# EAGLE design esq_ordenado (EAGLE 9.6.1)
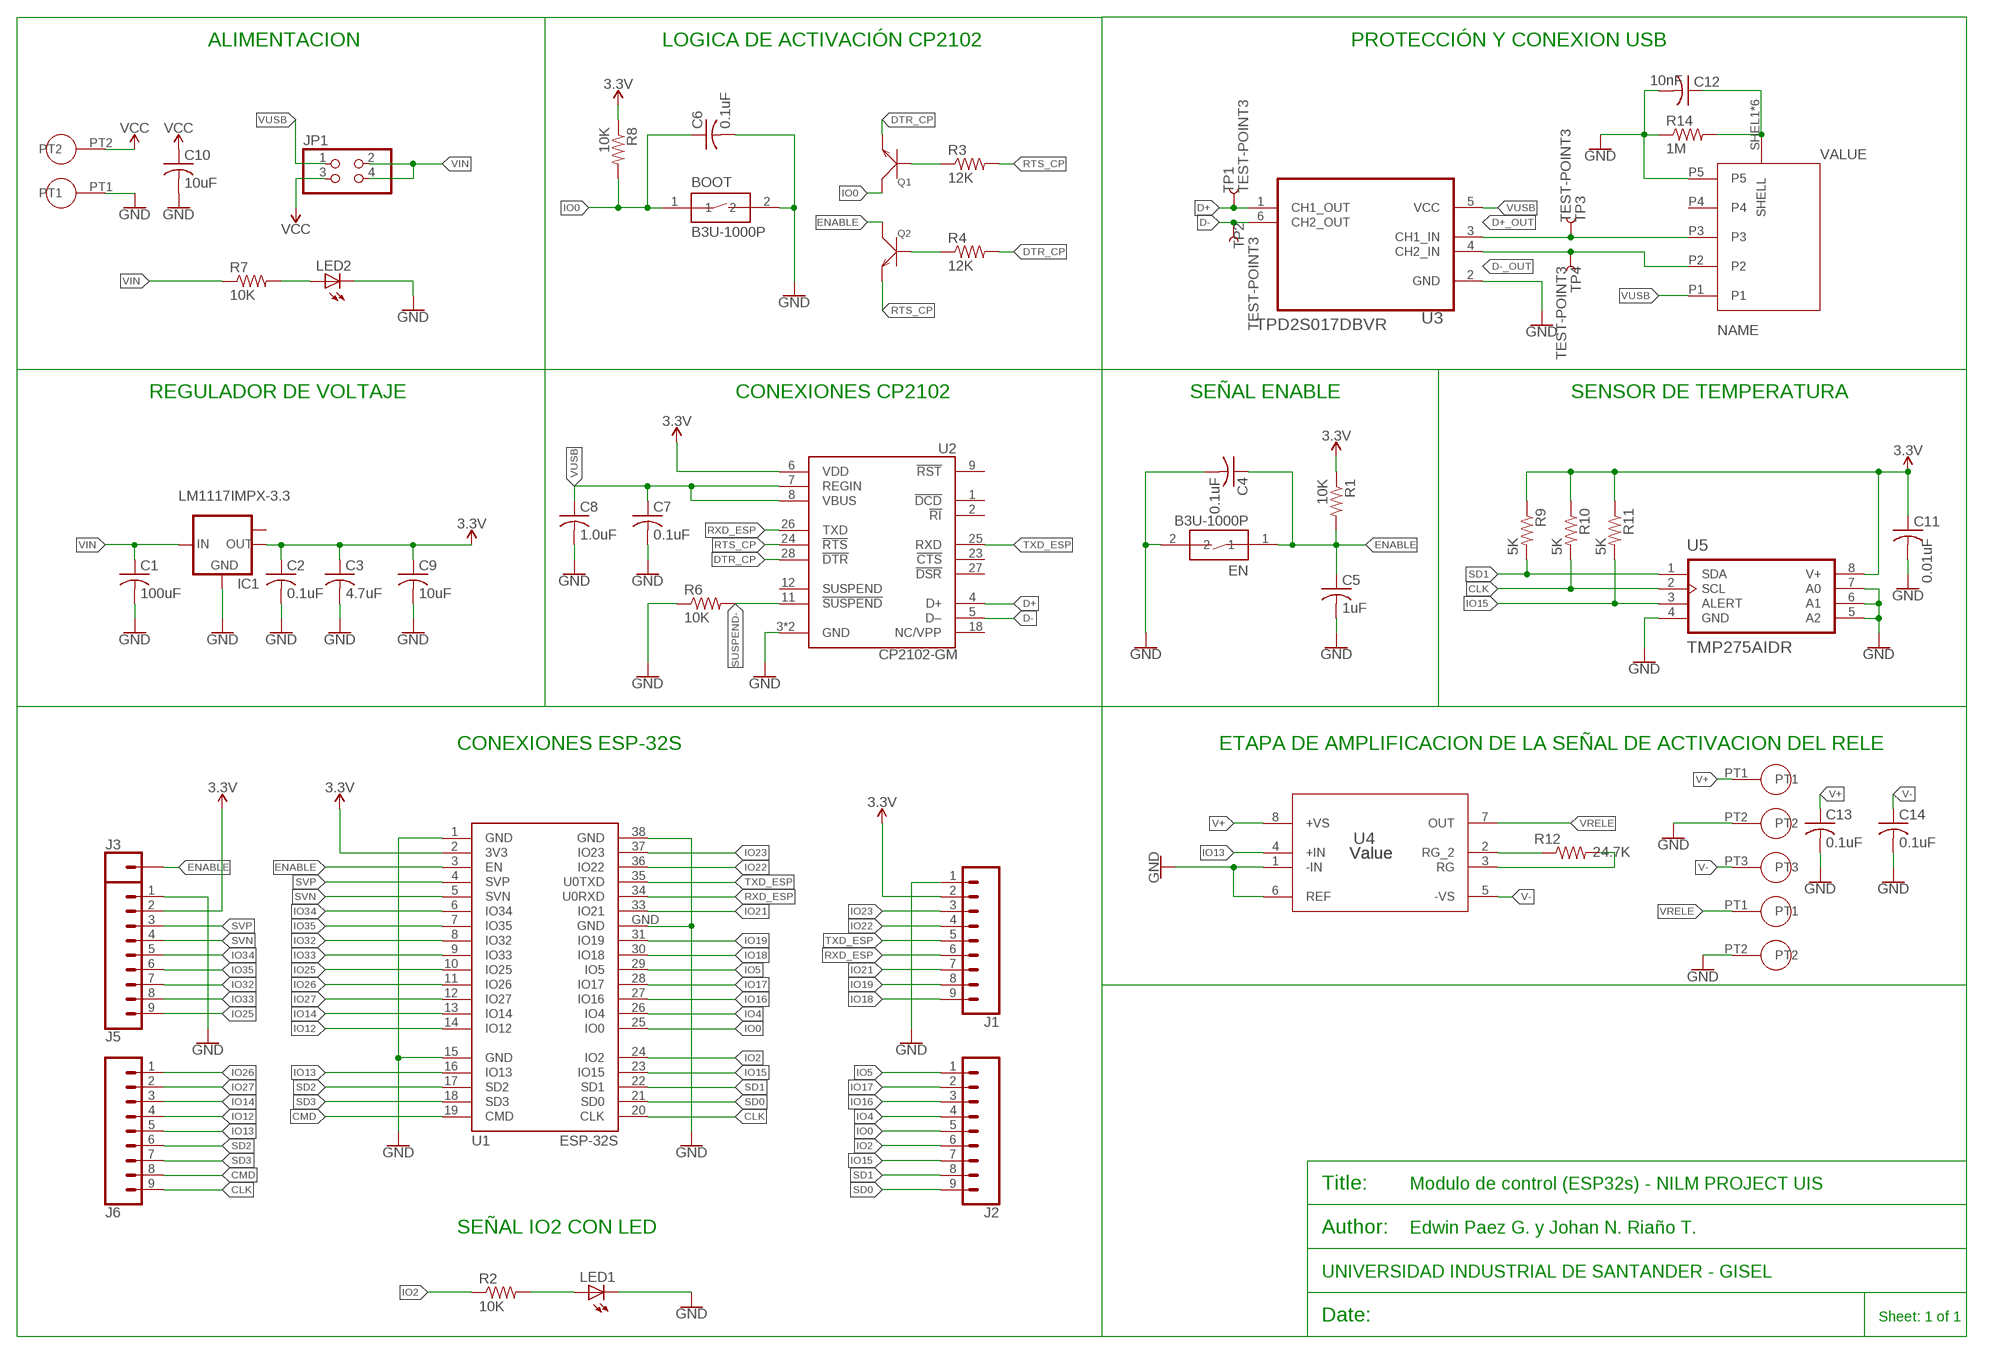
[diagram p0: schematic, sheet 1]

## Parts
BOOT  B3U-1000P  [B3U-1000P]
C1  100uF  C-USC0805  [C0805]
C2  0.1uF  C-USC0805  [C0805]
C3  4.7uF  C-USC0805  [C0805]
C4  0.1uF  C-USC0805  [C0805]
C5  1uF  C-USC0805  [C0805]
C6  0.1uF  C-USC0805  [C0805]
C7  0.1uF  C-USC0805  [C0805]
C8  1.0uF  C-USC0805  [C0805]
C9  10uF  C-USC0805  [C0805]
C10  10uF  C-USC0805  [C0805]
C11  0.01uF  C-USC0805  [C0805]
C12  10nF  C-USC0805  [C0805]
C13  0.1uF  C-USC0805  [C0805]
C14  0.1uF  C-USC0805  [C0805]
EN  B3U-1000P  [B3U-1000P]
IC1  LM1117IMPX-3.3  [SOT223]
J1  CONN_09  [1X09]
J2  CONN_09  [1X09]
J3  CONN_01  [1X01]
J5  CONN_09  [1X09]
J6  CONN_09  [1X09]
JP1  PINHD-2X2  [2X02]
LED1  LEDCHIPLED_0805  [CHIPLED_0805]
LED2  LEDCHIPLED_0805  [CHIPLED_0805]
Q1  SMD-TRANSISTORS-NPN-25V-500MW(SOT-23)  [SOT-23]
Q2  SMD-TRANSISTORS-NPN-25V-500MW(SOT-23)  [SOT-23]
R1  10K  R-US_R0805  [R0805]
R2  10K  R-US_R0805  [R0805]
R3  12K  R-US_R0805  [R0805]
R4  12K  R-US_R0805  [R0805]
R6  10K  R-US_R0805  [R0805]
R7  10K  R-US_R0805  [R0805]
R8  10K  R-US_R0805  [R0805]
R9  5K  R-US_R0805  [R0805]
R10  5K  R-US_R0805  [R0805]
R11  5K  R-US_R0805  [R0805]
R12  24.7K  R-US_R0805  [R0805]
R14  1M  R-US_R0805  [R0805]
TP1  TEST-POINT3  [PAD.03X.03]
TP2  TEST-POINT3  [PAD.03X.03]
TP3  TEST-POINT3  [PAD.03X.03]
TP4  TEST-POINT3  [PAD.03X.03]
U1  ESP-32S  [ESP-32S]
U2  CP2102-GM  [QFN50P500X500X100-29N]
U3  TPD2S017DBVR  [SOT95P280X145-6N]
U4  Value  INA821IDD0008A_M  [D0008A_M]
U5  TMP275AIDR  [TMP275AIDR]
U$1  MICRO_USB_B-AMPHENOL(10118192)  [MICRO_B_10118192]
U$2  PT2,5/2-5,0  [PT2,5/2-5,0]
U$3  PT2,5/2-5,0  [PT2,5/2-5,0]
U$4  PT2,5/3-5,0  [PT2,5/3-5,0]

## Nets
3.3V: C2.1 C3.1 C9.1 C11.1 IC1.2(OUT) J1.2 J5.2 R1.1 R8.1 R9.1 R10.1 R11.1 U1.2(3V3) U2.6(VDD) U5.8(V+)
CLK [PINES_ESP]: J6.9 R10.2 U1.20(CLK) U5.2(SCL)
CMD [PINES_ESP]: J6.8 U1.19(CMD)
D+: TP1.P$1 U2.4(D+) U3.1(CH1_OUT)
D+_OUT: TP3.P$1 U3.3(CH1_IN) U$1.P3
D-: TP2.P$1 U2.5(D–) U3.6(CH2_OUT)
D-_OUT: TP4.P$1 U3.4(CH2_IN) U$1.P2
DTR_CP: Q1.2(E) R4.2 U2.28(!DTR)
ENABLE [PINES_ESP]: C4.1 C5.1 EN.1 J3.1 Q2.3(C) R1.2 U1.3(EN)
GND: BOOT.2 C1.2 C2.2 C3.2 C4.2 C5.2 C6.2 C7.2 C8.2 C9.2 C10.2 C11.2 C12.2 C13.2 C14.2 EN.2 IC1.1(GND) J1.1 J5.1 LED1.C LED2.C R6.1 R14.1 U1.1(GND) U1.15(GND) U1.38(GND) U1.GND U2.3(GND) U2.29(GND) U3.2(GND) U4.1(-IN) U4.6(REF) U5.4(GND) U5.5(A2) U5.6(A1) U5.7(A0) U$1.P5 U$2.PT1 U$3.PT2 U$4.PT2
IO0 [PINES_ESP]: BOOT.1 C6.1 J2.5 Q1.3(C) R8.2 U1.25(IO0)
IO2 [PINES_ESP]: J2.6 R2.1 U1.24(IO2)
IO4 [PINES_ESP]: J2.4 U1.26(IO4)
IO5 [PINES_ESP]: J2.1 U1.29(IO5)
IO12 [PINES_ESP]: J6.4 U1.14(IO12)
IO13 [PINES_ESP]: J6.5 U1.16(IO13) U4.4(+IN)
IO14 [PINES_ESP]: J6.3 U1.13(IO14)
IO15 [PINES_ESP]: J2.7 R11.2 U1.23(IO15) U5.3(ALERT)
IO16 [PINES_ESP]: J2.3 U1.27(IO16)
IO17 [PINES_ESP]: J2.2 U1.28(IO17)
IO18 [PINES_ESP]: J1.9 U1.30(IO18)
IO19 [PINES_ESP]: J1.8 U1.31(IO19)
IO21 [PINES_ESP]: J1.7 U1.33(IO21)
IO22 [PINES_ESP]: J1.4 U1.36(IO22)
IO23 [PINES_ESP]: J1.3 U1.37(IO23)
IO25 [PINES_ESP]: J5.9 U1.10(IO25)
IO26 [PINES_ESP]: J6.1 U1.11(IO26)
IO27 [PINES_ESP]: J6.2 U1.12(IO27)
IO32 [PINES_ESP]: J5.7 U1.8(IO32)
IO33 [PINES_ESP]: J5.8 U1.9(IO33)
IO34 [PINES_ESP]: J5.5 U1.6(IO34)
IO35 [PINES_ESP]: J5.6 U1.7(IO35)
N$2: LED1.A R2.2
N$3: Q1.1(B) R3.1
N$4: Q2.1(B) R4.1
N$6: LED2.A R7.2
N$7: C12.1 R14.2 U$1.SHEL1(SHELL) U$1.SHEL2(SHELL) U$1.SHEL3(SHELL) U$1.SHEL4(SHELL) U$1.SHEL5(SHELL) U$1.SHEL6(SHELL)
N$8: R12.1 U4.2(RG_2)
N$9: R12.2 U4.3(RG)
RTS_CP: Q2.2(E) R3.2 U2.24(!RTS)
RXD_ESP [PINES_ESP]: J1.6 U1.34(U0RXD) U2.26(TXD)
SD0 [PINES_ESP]: J2.9 U1.21(SD0)
SD1 [PINES_ESP]: J2.8 R9.2 U1.22(SD1) U5.1(SDA)
SD2 [PINES_ESP]: J6.6 U1.17(SD2)
SD3 [PINES_ESP]: J6.7 U1.18(SD3)
SUSPEND-: R6.2 U2.11(!SUSPEND)
SVN [PINES_ESP]: J5.4 U1.5(SVN)
SVP [PINES_ESP]: J5.3 U1.4(SVP)
TXD_ESP [PINES_ESP]: J1.5 U1.35(U0TXD) U2.25(RXD)
V+: C13.1 U4.8(+VS) U$4.PT1
V-: C14.1 U4.5(-VS) U$4.PT3
VCC: C10.1 JP1.3 U$2.PT2
VIN: C1.1 IC1.3(IN) JP1.2 JP1.4 R7.1
VRELE: U4.7(OUT) U$3.PT1
VUSB: C7.1 C8.1 JP1.1 U2.7(REGIN) U2.8(VBUS) U3.5(VCC) U$1.P1
Unconnected: IC1.TAB(OUT1) U2.1(!DCD) U2.2(!RI) U2.9(!RST) U2.12(SUSPEND) U2.18(NC/VPP) U2.23(!CTS) U2.27(!DSR) U$1.P4

## Notes on the sheet
- ALIMENTACION | LOGICA DE ACTIVACIÓN CP2102 | PROTECCIÓN Y CONEXION USB
- REGULADOR DE VOLTAJE | CONEXIONES CP2102 | SEÑAL ENABLE | SENSOR DE TEMPERATURA
- CONEXIONES ESP-32S | ETAPA DE AMPLIFICACION DE LA SEÑAL DE ACTIVACION DEL RELE
- Title: | Modulo de control (ESP32s) - NILM PROJECT UIS
- SEÑAL IO2 CON LED | Author: | Edwin Paez G. y Johan N. Riaño T.
- UNIVERSIDAD INDUSTRIAL DE SANTANDER - GISEL
- Date: | Sheet: 1 of 1

## Library data of the parts
BOOT EN = Switch:B3U-1000P: SWITCH TACTILE SPST-NO 0.05A 12V Manufacturer's datasheet <https://omronfs.omron.com/en_US/ecb/products/pdf/en-b3u.pdf>; CREATED_BY: PCBLayout.com; DIGI_KEY_PART_NUMBER: SW1020CT-ND; MANUFACTURER: Omron Electronics Inc-EMC Div; MPN: B3U-1000P; PACKAGE: SPST-NO
C1-C14 = resistor:C-US: CAPACITOR, American symbol
IC1 = lm1117:LM1117IMPX-*
J1 J2 J5 J6 = SparkFun-Connectors:CONN_09: Multi connection point. Often used as Generic Header-pin footprint for 0.1 inch spaced/style header connections On any of the 0.1 inch spaced packages, you can populate with these: Break Away Headers - Straight <https://www.sparkfun.com/products/116> (PRT-00116) Break Away Male Headers - Right Angle <https://www.sparkfun.com/products/553> (PRT-00553) Female Headers <https://www.sparkfun.com/products/115> (PRT-00115) Break Away Headers - Machine Pin <https://www.sparkfun.com/products/117> (PRT-00117) Break Away Female Headers - Swiss Machine Pin <https://www.sparkfun.com/products/743> (PRT-00743) For SCREWTERMINALS and SPRING TERMINALS visit here: Screw Terimnals on SparkFun.com <https://www.sparkfun.com/search/results?term=Screw+Terminals> (5mm/3.5mm/2.54mm spacing) This device is also useful as a general connection point to wire up your design to another part of your project. Our various solder wires solder well into these plated through hole pads. Hook-Up Wire - Assortment (Stranded, 22 AWG) <https://www.sparkfun.com/products/11375> (PRT-11375) Hook-Up Wire - Assortment (Solid Core, 22 AWG) <https://www.sparkfun.com/products/11367> (PRT-11367) View the entire wire category on our website here <https://www.sparkfun.com/categories/141> Special notes: Molex polarized connector foot print use with SKU : PRT-08231 with associated crimp pins and housings. 1MM SMD Version SKU: PRT-10208 NOTES ON THE VARIANTS LOCK and LOCK_LONGPADS... This footprint was designed to help hold the alignment of a through-hole component (i.e. 6-pin header) while soldering it into place. You may notice that each hole has been shifted either up or down by 0.005 of an inch from it's more standard position (which is a perfectly straight line). This slight alteration caused the pins (the squares in the middle) to touch the edges of the holes. Because they are alternating, it causes a "brace" to hold the component in place. 0.005 has proven to be the perfect amount of "off-center" position when using our standard breakaway headers. Although looks a little odd when you look at the bare footprint, once you have a header in there, the alteration is very hard to notice. Also,if you push a header all the way into place, it is covered up entirely on the bottom side.
J3 = SparkFun-Connectors:CONN_01: Single connection point. Often used as Generic Header-pin footprint for 0.1 inch spaced/style header connections On any of the 0.1 inch spaced packages, you can populate with these: Break Away Headers - Straight <https://www.sparkfun.com/products/116> (PRT-00116) Break Away Male Headers - Right Angle <https://www.sparkfun.com/products/553> (PRT-00553) Female Headers <https://www.sparkfun.com/products/115> (PRT-00115) Break Away Headers - Machine Pin <https://www.sparkfun.com/products/117> (PRT-00117) Break Away Female Headers - Swiss Machine Pin <https://www.sparkfun.com/products/743> (PRT-00743) This device is also useful as a general connection point to wire up your design to another part of your project. Our various solder wires solder well into these plated through hole pads. Hook-Up Wire - Assortment (Stranded, 22 AWG) <https://www.sparkfun.com/products/11375> (PRT-11375) Hook-Up Wire - Assortment (Solid Core, 22 AWG) <https://www.sparkfun.com/products/11367> (PRT-11367) View the entire wire category on our website here <https://www.sparkfun.com/categories/141> Special notes: SMTSO-256-ET is a "flush mount" nut for a 4-40 screw. We mostly use this on specialty testbeds; it is a nice way to connect hardware to your PCB at an adjustable hieght. Also note, the SNAP packages are for using a snappable style connector. We sell a baggie of snaps and they are also used on two LilyPad designs: Snap Assortment - 30 pack (male and female) <https://www.sparkfun.com/products/11347> (DEV-11347) LilyPad Arduino SimpleSnap <https://www.sparkfun.com/products/10941> (DEV-10941) LilyPad SimpleSnap Protoboard <https://www.sparkfun.com/products/10940> (DEV-10940)
JP1 = pinhead:PINHD-2X2: PIN HEADER
LED1 LED2 = adafruit:LED: LED OSRAM: - CHIPLED LG R971, LG N971, LY N971, LG Q971, LY Q971, LO R971, LY R971 LH N974, LH R974 LS Q976, LO Q976, LY Q976 LO Q996 - Hyper CHIPLED LW Q18S LB Q993, LB Q99A, LB R99A - SideLED LS A670, LO A670, LY A670, LG A670, LP A670 LB A673, LV A673, LT A673, LW A673 LH A674 LY A675 LS A676, LA A676, LO A676, LY A676, LW A676 LS A679, LY A679, LG A679 - Hyper Micro SIDELED® LS Y876, LA Y876, LO Y876, LY Y876 LT Y87S - SmartLED LW L88C, LW L88S LB L89C, LB L89S, LG L890 LS L89K, LO L89K, LY L89K LS L896, LA L896, LO L896, LY L896 - TOPLED LS T670, LO T670, LY T670, LG T670, LP T670 LSG T670, LSP T670, LSY T670, LOP T670, LYG T670 LG T671, LOG T671, LSG T671 LB T673, LV T673, LT T673, LW T673 LH T674 LS T676, LA T676, LO T676, LY T676, LB T676, LH T676, LSB T676, LW T676 LB T67C, LV T67C, LT T67C, LS T67K, LO T67K, LY T67K, LW E67C LS E67B, LA E67B, LO E67B, LY E67B, LB E67C, LV E67C, LT E67C LW T67C LS T679, LY T679, LG T679 LS T770, LO T770, LY T770, LG T770, LP T770 LB T773, LV T773, LT T773, LW T773 LH T774 LS E675, LA E675, LY E675, LS T675 LS T776, LA T776, LO T776, LY T776, LB T776 LHGB T686 LT T68C, LB T68C - Hyper Mini TOPLED® LB M676 - Mini TOPLED Santana® LG M470 LS M47K, LO M47K, LY M47K Source: http://www.osram.convergy.de/
Q1 Q2 = SMD-TRANSISTORS-NPN-25V-500MW_SOT-23_:SMD-TRANSISTORS-NPN-25V-500MW(SOT-23): 305010017; AVAILABILITY: Unavailable; MF: Recom Power; MP: S8050; PACKAGE: SOT-23 Micro Commercial; PRICE: None
R1-R4 R6-R12 R14 = resistor:R-US_: RESISTOR, American symbol
TP1-TP4 = SparkFun-Connectors:TEST-POINT: SparkFun Test Points Bare copper test points for troubleshooting or In-Circuit-Testing. These are used by our Production team for verifying production board runs using pogo-pins on test beds. SparkFun Products: SparkFun LSM9DS1 Breakout <https://www.sparkfun.com/products/13284> SparkFun PSOC <https://www.sparkfun.com/products/13714> SparkFun Load Cell Amplifier <https://www.sparkfun.com/products/13879>
U1 = esp32:ESP-32S: Ai-Thinker ESP-32S
U2 = CP2102-GM:CP2102-GM: IC USB-TO-UART BRIDGE 28VQFN; AVAILABILITY: Unavailable; DESCRIPTION: Microcontroller Solutions - Interface Products USB to UART Bdg Chip; MF: Silicon Labs; MP: CP2102-GM; PACKAGE: QFN-28 Silicon Labs; PRICE: None
U3 = TPD2S017DBVR:TPD2S017DBVR: 2-CHANNEL ULTRA-LOW CLAMP VOLTAGE ESD SOLUTION WITH SERIES-RESISTOR ISOLATION; DESCRIPTION: 2-Channel Ultra Low Clamp Voltage ESD Solution with Series-Resistor Isolation 6-SOT-23 -40 to 85; DIGI-KEY_PART_NUMBER: 296-25216-1-ND; DIGI-KEY_PURCHASE_URL: https://www.digikey.com/product-detail/en/texas-instruments/TPD2S017DBVR/296-25216-1-ND/2172703?utm_source=snapeda&utm_medium=aggregator&utm_campaign=symbol; MF: Texas Instruments; MP: TPD2S017DBVR; PACKAGE: SOT-23-6 Texas Instruments
U4 = INA821ID_TI:INA821ID; MANUFACTURER: Texas Instruments; PARTNUMBER: INA821ID; REFDES: RefDes; TYPE: TYPE
U5 = Sensor:TMP275AIDR: SENSOR DIGITAL -40C-125C 8SOIC Manufacturer's datasheet <http://www.ti.com/lit/ds/symlink/tmp275.pdf>; CREATED_BY: PCBLayout.com; DIGIKEY_PART_NUMBER: 296-39296-2-ND; MANUFACTURER: Texas Instruments; MPN: TMP275AIDR; PACKAGE: 8-SOIC
U$1 = usb_microB_10118192:MICRO_USB_B-AMPHENOL(10118192): MICRO USB B TYPE RECEPTACLE (10118192) - AMPHENOL
U$2 U$3 = con_phoenix:PT2,5/2-5,0: Phoenix Contact -- PT 2,5/ 2 - 5,0. Block pin 5,0 mm distance, 2 positions SOURCE: https://media.digikey.com/pdf/Data%20Sheets/Phoenix%20Contact%20PDFs/PT-2-5-2-5-0-H_Dwg.pdf
U$4 = con_phoenix:PT2,5/3-5,0: Phoenix Contact -- PT 2,5/ 2 - 5,0. Block pin 5,0 mm distance, 2 positions SOURCE: https://media.digikey.com/pdf/Data%20Sheets/Phoenix%20Contact%20PDFs/PT-2-5-2-5-0-H_Dwg.pdf

## Board
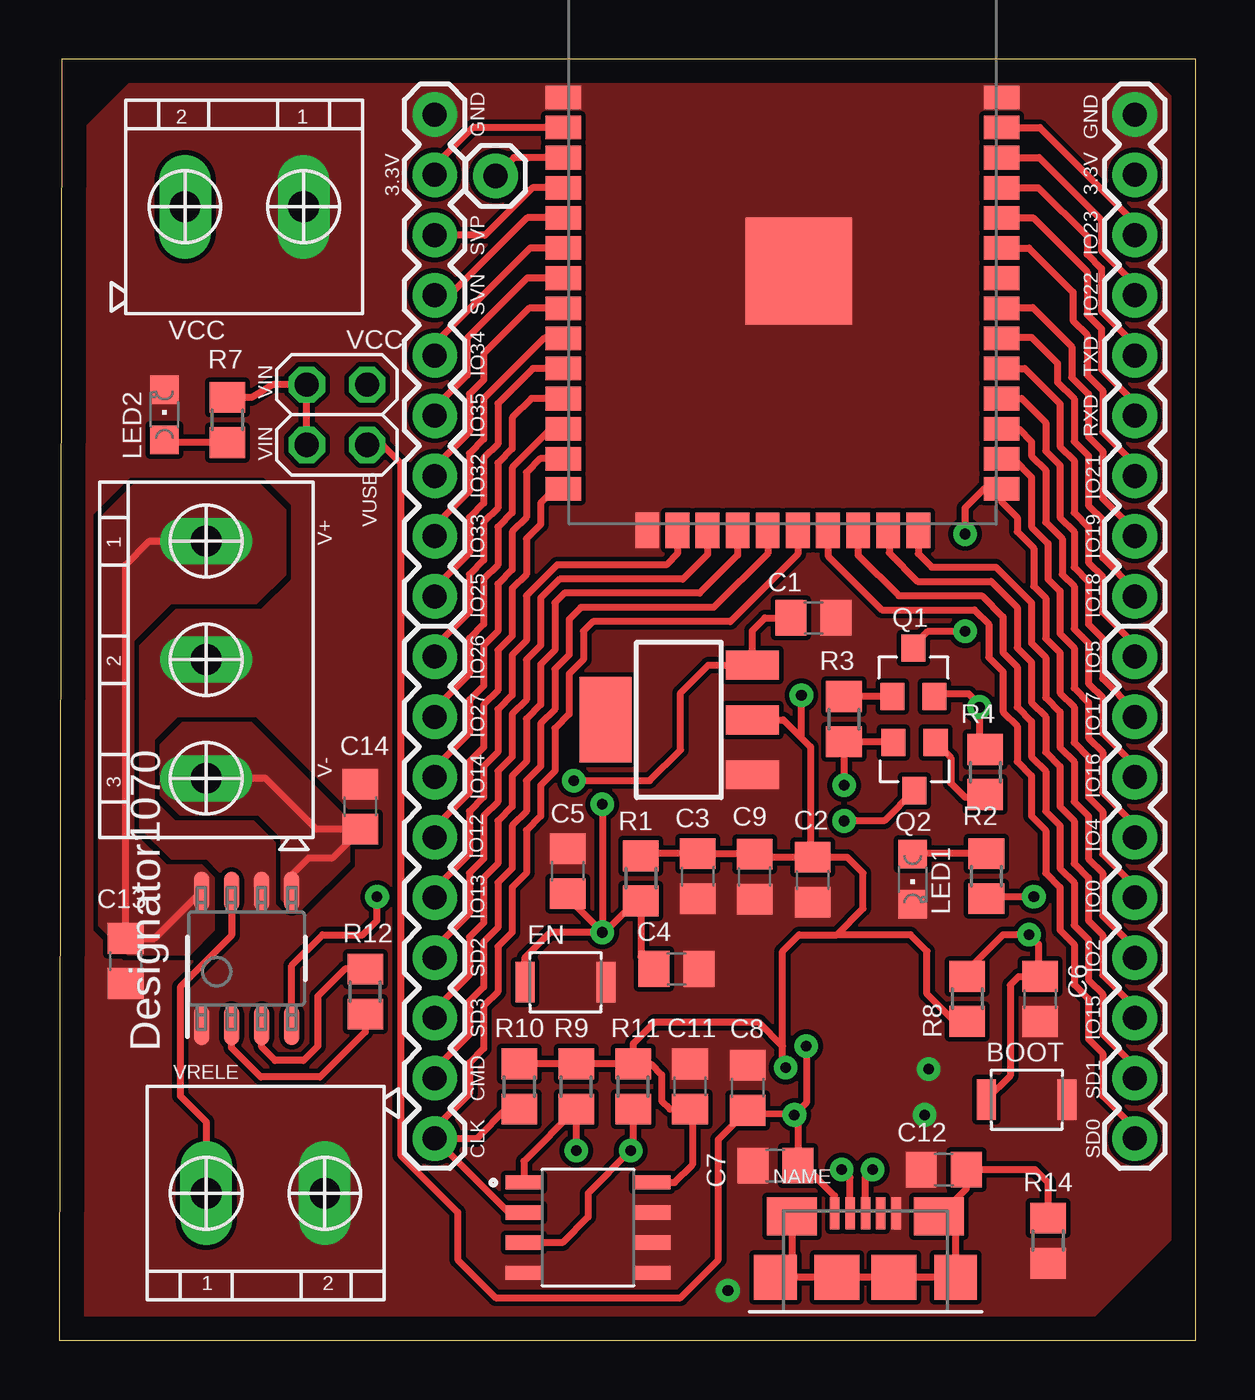
[diagram p1: board, top side]
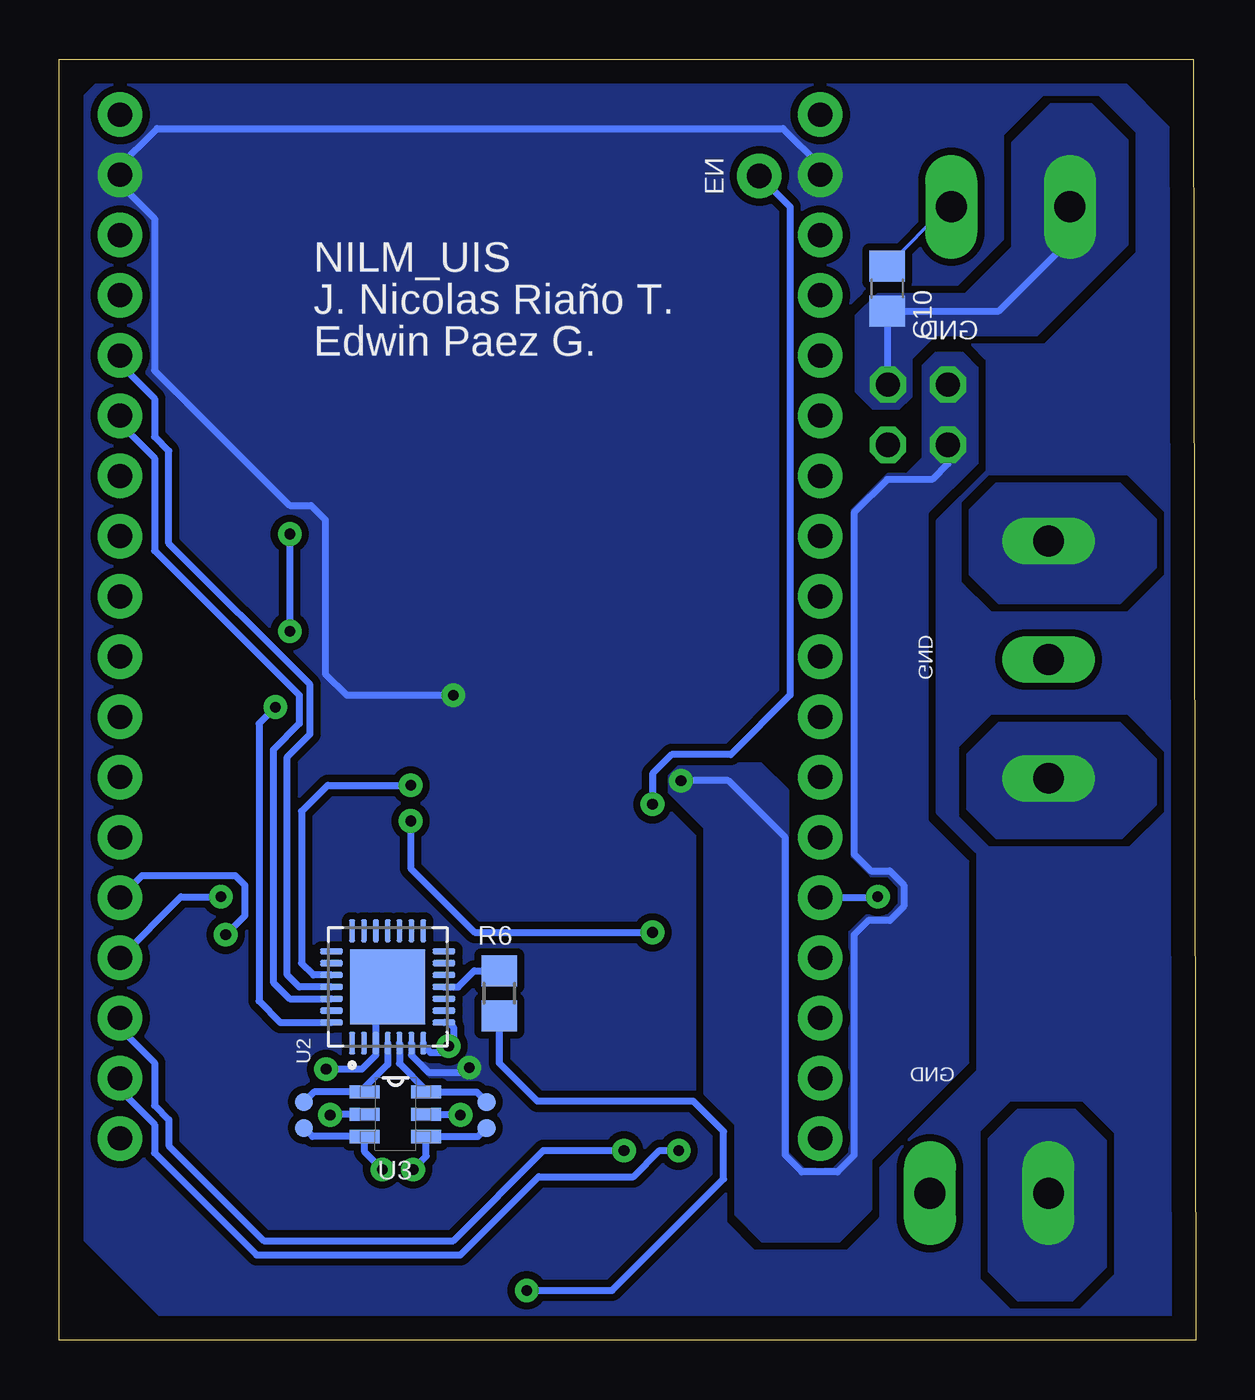
[diagram p2: board, bottom side, seen from below]

Size 47.92 x 54.02 mm. Coordinates in mm from the lower left corner, seen from the top.
Outline: 0,0 47.92,0 47.92,54.02 0.1,54.02 0,0
Copper layers (1*16): Top 0.035mm / dielectric 1.5mm / Bottom 0.035mm
Design rules "default": minimum track width 6mil, minimum drill 0.35mm, track to track 6mil, track to pad 6mil, pad to pad 6mil, via to via 6mil, smd to smd 6mil, copper to edge 40mil, drill to drill 6mil, minimum pad ring 10mil, minimum via ring 8mil, stop-mask expansion 4mil, vias tented up to drill 0mil, thermal gap 10mil

### Footprints (pad centres in the part's own frame; a part is rotated, then mirrored left to right if it is on the bottom)
B3U-1000P = smd 0.8 x 1.7: 1 -1.7,0; 2 1.7,0
C0805 = smd 1.3 x 1.5: 1 -0.95,0; 2 0.95,0
SOT223 = smd 1.219 x 2.235: 1 -2.311,-3.099; 2 0,-3.099; 3 2.311,-3.099 | smd 3.6 x 2.2: TAB 0,3.099
1X09 = drill 1.016 pad 1.88: 1 0,0; 2 2.54,0; 3 5.08,0; 4 7.62,0; 5 10.16,0; 6 12.7,0; 7 15.24,0; 8 17.78,0; 9 20.32,0
1X01 = drill 1.016 pad 1.88: 1 0,0
2X02 = drill 1.016 octagon: 1 -1.27,-1.27; 2 -1.27,1.27; 3 1.27,-1.27; 4 1.27,1.27
CHIPLED_0805 = smd 1.2 x 1.2: A 0,-1.05; C 0,1.05
SOT-23 = smd 1.016 x 1.143: 1 -0.889,-1.016; 2 0.889,-1.016; 3 0,1.016
R0805 = smd 1.3 x 1.5: 1 -0.95,0; 2 0.95,0
PAD.03X.03 = smd 0.762 x 0.762: P$1 0,0
ESP-32S = smd 1.5 x 1: 1 -9.25,7; 2 -9.25,5.73; 3 -9.25,4.46; 4 -9.25,3.19; 5 -9.25,1.92; 6 -9.25,0.65; 7 -9.25,-0.62; 8 -9.25,-1.89; 9 -9.25,-3.16; 10 -9.25,-4.43; 11 -9.25,-5.7; 12 -9.25,-6.97; 13 -9.25,-8.24; 14 -9.25,-9.51; 25 9.25,-9.51; 26 9.25,-8.24; 27 9.25,-6.97; 28 9.25,-5.7; 29 9.25,-4.43; 30 9.25,-3.16; 31 9.25,-1.89; 32 9.25,-0.62; 33 9.25,0.65; 34 9.25,1.92; 35 9.25,3.19; 36 9.25,4.46; 37 9.25,5.73; 38 9.25,7 | smd 1 x 1.5: 15 -5.7,-11.25; 16 -4.43,-11.25; 17 -3.16,-11.25; 18 -1.89,-11.25; 19 -0.62,-11.25; 20 0.65,-11.25; 21 1.92,-11.25; 22 3.19,-11.25; 23 4.46,-11.25; 24 5.73,-11.25 | smd 4.5 x 4.5: GND 0.68,-0.33
QFN50P500X500X100-29N = smd 0.97 x 0.26: 1 -2.37,1.5; 2 -2.37,1; 3 -2.37,0.5; 4 -2.37,0; 5 -2.37,-0.5; 6 -2.37,-1; 7 -2.37,-1.5; 15 2.37,-1.5; 16 2.37,-1; 17 2.37,-0.5; 18 2.37,0; 19 2.37,0.5; 20 2.37,1; 21 2.37,1.5 | smd 0.26 x 0.97: 8 -1.5,-2.37; 9 -1,-2.37; 10 -0.5,-2.37; 11 0,-2.37; 12 0.5,-2.37; 13 1,-2.37; 14 1.5,-2.37; 22 1.5,2.37; 23 1,2.37; 24 0.5,2.37; 25 0,2.37; 26 -0.5,2.37; 27 -1,2.37; 28 -1.5,2.37 | smd 3.15 x 3.15: 29 0,0
SOT95P280X145-6N = smd 1.27 x 0.559: 1 -1.295,0.94; 2 -1.295,0; 3 -1.295,-0.94; 4 1.295,-0.94; 5 1.295,0; 6 1.295,0.94
D0008A_M = smd 1.65 x 0.65: 1 -2.825,1.905; 2 -2.825,0.635; 3 -2.825,-0.635; 4 -2.825,-1.905; 5 2.825,-1.905; 6 2.825,-0.635; 7 2.825,0.635; 8 2.825,1.905
TMP275AIDR = smd 1.55 x 0.6: 1 -2.7,1.905; 2 -2.7,0.635; 3 -2.7,-0.635; 4 -2.7,-1.905; 5 2.7,-1.905; 6 2.7,-0.635; 7 2.7,0.635; 8 2.7,1.905
MICRO_B_10118192 = smd 0.4 x 1.35: P1 -1.3,2.7; P2 -0.65,2.7; P3 0,2.7; P4 0.65,2.7; P5 1.3,2.7 | smd 2.1 x 1.6: SHEL1 -3.1,2.575; SHEL6 3.1,2.575 | smd 1.8 x 1.9: SHEL2 -3.8,0; SHEL5 3.8,0 | smd 1.9 x 1.9: SHEL3 -1.2,0; SHEL4 1.2,0
PT2,5/2-5,0 = drill 1.3 pad 2.184 long: PT1 -2.5,0; PT2 2.5,0
PT2,5/3-5,0 = drill 1.3 pad 1.93 long: PT1 -5,0; PT2 0,0; PT3 5,0

### Placement (x,y rotation side)
BOOT  40.8,10.15 0 top
C1  31.81,30.46 0 top
C2  31.78,19.42 270 top
C3  26.92,19.57 270 top
C4  26.03,15.66 0 top
C5  21.45,19.78 90 top
C6  41.36,14.39 270 top
C7  30.2,7.37 180 top
C8  29.03,10.65 90 top
C9  29.32,19.55 270 top
C10  13,44.35 90 bottom
C11  26.6,10.7 90 top
C12  37.3,7.2 180 top
C13  2.8,16 270 top
C14  12.7,22.5 90 top
EN  21.35,15.1 0 top
IC1  26.13,26.16 90 top
J1  45.36,51.69 270 top
J2  45.36,28.83 270 top
J3  18.4,49.1 0 top
J5  15.83,51.69 270 top
J6  15.83,28.83 270 top
JP1  11.71,39.03 90 top
LED1  35.99,19.44 180 top
LED2  4.44,39.03 0 top
Q1  36.02,28.17 0 top
Q2  36.07,24.19 180 top
R1  24.53,19.48 270 top
R2  39.1,19.57 90 top
R3  33.09,26.19 270 top
R4  39.05,23.96 90 top
R6  29.36,14.63 90 bottom
R7  7.09,38.81 270 top
R8  38.29,14.4 90 top
R9  21.8,10.7 270 top
R10  19.4,10.7 270 top
R11  24.2,10.7 270 top
R12  12.9,14.7 90 top
R14  41.7,4.2 90 top
TP1  37.6,10.05 0 bottom
TP2  29.9,10.05 0 bottom
TP3  37.6,8.95 0 bottom
TP4  29.9,8.95 0 bottom
U1  30.5,45.41 0 top
U2  34.07,14.9 90 bottom
U3  33.74,9.53 0 bottom
U4  7.9,16.1 90 top
U5  22.3,4.75 0 top
U$1  34,2.65 0 top
U$2  7.8,47.8 180 top
U$3  8.7,6.2 0 top
U$4  6.2,28.7 270 top

### Tracks (layer width: path | path; a pad name or v marks a point on that pad's centre or on a via)
3.3V  (via drill 0.45 pad 1)
  Top 0.305: U1.2 17.44,51.14 15.83,49.53 J5.2 | IC1.2 30.54,26.16 31.28,25.42 | 31.28,25.42 31.68,25.02 31.68,20.47 C2.1 | C2.1 29.45,20.37 C9.1 26.94,20.5 C3.1 24.62,20.52 R1.1 | C2.1 32.33,20.37 | v30.63,11.5 30.5,11.63 30.5,12.4 | 30.5,12.4 29.5,13.4 25.1,13.4 24.2,12.5 R11.1 | R9.1 22,11.65 | U5.8 25.95,6.66 26.7,7.4 26.7,9.65 C11.1 25.75,9.75 25.4,10.1 25.4,11.2 24.95,11.65 R11.1 | R11.1 R9.1 | R9.1 R10.1 | R8.1 37.75,13.45 36.6,14.6 36.6,16.4 35.9,17.1 32.8,17.1 | C2.1 33.23,20.37 33.9,19.7 33.9,18.2 32.8,17.1 | 30.5,12.4 30.5,16.4 31.2,17.1 32.8,17.1 | v31.3,27.2 31.28,27.18 31.28,25.42
  Bottom 0.305: U2.6 33.07,12.02 32.35,11.3 30.83,11.3 v30.63,11.5 30.6,11.5 | J5.2 15.83,49.53 17.4,51.1 43.8,51.1 45.5,49.4 45.5,49.29 J1.2 45.36,48.76 43.9,47.3 43.9,40.9 38.2,35.2 37.3,35.2 36.7,34.6 36.7,28.1 35.8,27.2 v31.3,27.2
  pour Bottom (isolate 0.305, rank 3, no thermals): 0.7,50.7 3.6,53.6 45.7,53.6 46.9,52.4 46.9,4.3 43.7,1.1 0.7,1.1
CLK
  Top 0.305: U1.20 31.15,33.15 28.3,30.3 22.5,30.3 22.1,29.9 22.1,28.7 21.5,28.1 21.5,26.4 20.9,25.8 20.9,24 20.3,23.4 20.3,22.1 19.7,21.5 19.7,19.7 19.1,19.1 19.1,17.2 18.5,16.6 18.5,14.7 17.9,14.1 17.9,12.3 17.3,11.7 17.3,10.4 15.83,8.93 J6.9 | U5.2 18.95,5.38 J6.9 | R10.2 18.85,9.75 17.6,8.5 J6.9
CMD
  Top 0.305: U1.19 29.88,33.18 27.6,30.9 22,30.9 21.5,30.4 21.5,28.9 20.9,28.3 20.9,26.6 20.3,26 20.3,24.2 19.7,23.6 19.7,22.3 19.1,21.7 19.1,19.9 18.5,19.3 18.5,17.4 17.9,16.8 17.9,14.9 17.3,14.3 17.3,12.9 15.83,11.43 J6.8
D+
  Bottom 0.305: U2.4 34.07,11.63 35.03,10.66 U3.1 37.18,10.47 TP1.P$1
D+_OUT  (via drill 0.45 pad 1)
  Top 0.305: U$1.P3 34,6.9 v34.3,7.2
  Bottom 0.305: v34.3,7.2 35.03,7.93 U3.3 37.24,8.59 TP3.P$1
D-
  Bottom 0.305: U2.5 33.57,11.67 32.45,10.54 U3.6 30.32,10.47 TP2.P$1
D-_OUT  (via drill 0.45 pad 1)
  Top 0.305: U$1.P2 33.35,6.85 v33,7.2
  Bottom 0.305: v33,7.2 32.45,7.75 U3.4 30.26,8.59 TP4.P$1
DTR_CP  (via drill 0.45 pad 1)
  Top 0.305: R4.2 38.8,25.16 v38.8,26.7 38.8,26.81 38.35,27.25 37.01,27.25 Q1.2
  Bottom 0.305: v38.8,26.7 39.5,26 39.5,14.3 38.6,13.4 U2.28
ENABLE  (via drill 0.45 pad 1)
  Top 0.305: U1.3 19.17,49.87 J3.1 | Q2.3 34.8,21.9 v33.1,21.9 | C5.1 21.7,18.83 21.6,18.73 21.6,18.5 v22.9,17.2 | C4.1 25.04,15.66 24.53,16.17 R1.2 24.33,18.53 23,17.2 v22.9,17.2 | v22.9,22.6 v22.9,17.2 | EN.1 19.65,16.15 20.7,17.2 v22.9,17.2
  Bottom 0.305: v33.1,21.9 33.1,19.9 30.4,17.2 v22.9,17.2 | J3.1 17.1,47.8 17.1,27.2 19.6,24.7 22.1,24.7 22.9,23.9 v22.9,22.6
GND  (via drill 0.45 pad 1)
  Bottom 0.152: C10.2 10.5,47.8 U$2.PT1
  Bottom 0.305: U3.2 36.47,9.53 v36.5,9.5 | U2.29 34.57,14.4 U2.3 34.57,12.02 35.16,11.43 v36.67,11.43 | v28.2,2.1 24.6,2.1 19.9,6.8 19.9,8.8 21.18,10.08 27.76,10.08 29.36,11.68 R6.1
  pour Top (isolate 0.2, rank 3, no thermals): 0.8,1 43.6,1 46.9,4.3 46.9,52.4 45.7,53.6 3.6,53.6 0.8,50.8
IO0  (via drill 0.45 pad 1)
  Top 0.305: J2.5 45.36,19.14 44,20.5 44,22.3 43.4,22.9 43.4,24.6 42.8,25.2 42.8,26.7 42.2,27.3 42.2,29 41.6,29.6 41.6,31.3 41.1,31.8 41.1,33.4 40.4,34.1 40.4,34.7 39.75,35.35 U1.25 39,35.9 38.2,35.1 v38.2,34 | v38.2,29.89 38.2,29.89 36.62,29.89 36.02,29.29 Q1.3 | BOOT.1 40.1,11.15 40.1,14.98 40.46,15.34 C6.1 41.3,15.4 41.3,16.7 v40.9,17.1 39.8,17.1 38.29,15.59 R8.2
  Bottom 0.305: v38.2,34 v38.2,29.89 | J2.5 44.43,19.6 40.5,19.6 40.1,19.2 40.1,17.9 v40.9,17.1
IO2  (via drill 0.45 pad 1)
  Top 0.305: U1.24 36.23,33.17 36.8,32.6 39.5,32.6 41,31.1 41,29.4 41.6,28.8 41.6,27.1 42.2,26.5 42.2,25 42.8,24.4 42.8,22.7 43.4,22.1 43.4,20.3 44,19.7 44,17.9 45.36,16.54 J2.6 | v41.1,18.7 39.18,18.7 R2.1
  Bottom 0.305: J2.6 42.79,18.7 v41.1,18.7
IO4
  Top 0.305: U1.26 40.23,37.17 41,36.4 41,34.3 41.7,33.6 41.7,32.1 42.2,31.6 42.2,29.8 42.8,29.2 42.8,27.5 43.4,26.9 43.4,25.4 44,24.8 44,23.1 45.36,21.74 J2.4
IO5
  Top 0.305: U1.29 40.72,40.98 42.21,39.49 42.21,37.69 42.8,37.1 42.8,34.9 43.4,34.3 43.4,32.8 44,32.2 44,30.7 45.36,29.34 J2.1
IO12
  Top 0.305: U1.14 20.9,35.9 20.3,35.3 20.3,34.4 19.7,33.8 19.7,32.3 19.1,31.7 19.1,29.7 18.5,29.1 18.5,27.4 17.9,26.8 17.9,25 17.3,24.4 17.3,23.1 15.83,21.63 J6.4
IO13  (via drill 0.45 pad 1)
  Top 0.305: U1.16 26.07,33.17 25.6,32.7 21,32.7 19.7,31.4 19.7,29.5 19.1,28.9 19.1,27.2 18.5,26.6 18.5,24.8 17.9,24.2 17.9,22.9 17.3,22.3 17.3,20.5 15.83,19.03 J6.5 | U4.4 9.8,15.8 11.1,17.1 12.8,17.1 13.4,17.7 v13.4,18.7
  Bottom 0.305: J6.5 13.43,18.67 v13.4,18.7
IO14
  Top 0.305: U1.13 20.27,37.17 19.7,36.6 19.7,34.7 19.1,34.1 19.1,32.5 18.5,31.9 18.5,29.9 17.9,29.3 17.9,27.6 17.3,27 17.3,25.6 15.83,24.13 J6.3
IO15  (via drill 0.45 pad 1)
  Top 0.305: U1.23 35,34.12 35,33.2 36.2,32 39.3,32 40.4,30.9 40.4,29.2 41,28.6 41,26.9 41.6,26.3 41.6,24.8 42.2,24.2 42.2,22.5 42.8,21.9 42.8,20.1 43.4,19.5 43.4,17.7 44,17.1 44,15.4 45.36,14.04 J2.7 | R11.2 24.2,8.1 v24.1,8 22.3,6.2 22.3,5.2 21.21,4.12 U5.3
  Bottom 0.305: J2.7 45.36,13.16 43.9,11.7 43.9,9.9 43.3,9.3 43.3,8.2 39.3,4.2 31.3,4.2 27.5,8 v24.1,8
IO16
  Top 0.305: U1.27 40.46,38.44 41.01,37.9 41.01,37.3 41.6,36.7 41.6,34.5 42.3,33.8 42.3,32.3 42.8,31.8 42.8,30 43.4,29.4 43.4,27.7 44,27.1 44,25.6 45.36,24.24 J2.3
IO17
  Top 0.305: U1.28 40.59,39.71 41.6,38.7 41.6,37.5 42.2,36.9 42.2,34.7 42.8,34.1 42.8,32.6 43.4,32 43.4,30.2 44,29.6 44,27.9 45.36,26.54 J2.2
IO18
  Top 0.305: U1.30 39.8,42.3 41,42.3 42.1,41.2 42.1,40.4 42.8,39.7 42.8,37.9 43.4,37.3 43.4,35.2 44,34.6 44,33 45.36,31.64 J1.9
IO19
  Top 0.305: U1.31 39.78,43.55 41.05,43.55 42.7,41.9 42.7,40.6 43.4,39.9 43.4,38.1 44,37.5 44,35.5 45.36,34.14 J1.8
IO21
  Top 0.305: U1.33 40.9,46.06 42.75,44.21 42.75,43 43.35,42.4 43.35,40.7 44,40.05 44,38.3 45.36,36.94 J1.7
IO22
  Top 0.305: U1.36 41.33,49.87 43.95,47.25 43.95,45.95 45.36,44.54 J1.4
IO23
  Top 0.305: U1.37 41.36,51.14 45.36,47.14 J1.3
IO25
  Top 0.305: U1.10 19.98,40.98 18.5,39.5 18.5,37.8 17.9,37.2 17.9,35.3 17.3,34.7 17.3,33.2 15.83,31.73 J5.9
IO26
  Top 0.305: U1.11 19.91,39.71 19.1,38.9 19.1,37.6 18.5,37 18.5,35.1 17.9,34.5 17.9,32.9 17.3,32.3 17.3,30.7 15.83,29.23 J6.1
IO27
  Top 0.305: U1.12 20.74,38.44 19.1,36.8 19.1,34.9 18.5,34.3 18.5,32.7 17.9,32.1 17.9,30.2 17.3,29.6 17.3,28.1 15.83,26.63 J6.2
IO32
  Top 0.305: U1.8 19.82,43.52 17.9,41.6 17.9,40.5 17.3,39.9 17.3,38.3 15.83,36.83 J5.7
IO33
  Top 0.305: U1.9 20.45,42.25 17.9,39.7 17.9,38 17.3,37.4 17.3,35.8 15.83,34.33 J5.8
IO34
  Top 0.305: U1.6 19.86,46.06 15.83,42.03 J5.5
IO35
  Top 0.305: J5.6 15.83,39.33 17.2,40.7 17.2,42.25 19.74,44.79 U1.7
N$2
  Top 0.305: LED1.A 36.02,20.52 R2.2
N$3
  Top 0.305: Q1.1 35.12,27.14 R3.1
N$4
  Top 0.305: Q2.1 37.6,24.57 37.6,23.5 38.2,22.9 38.94,22.9 R4.1
N$6
  Top 0.305: LED2.A 4.56,37.86 R7.2
N$7
  Top 0.305: R14.2 41.7,6.65 41.15,7.2 C12.1 38.25,6.38 U$1.SHEL6 37.8,4.53 U$1.SHEL5 U$1.SHEL4 U$1.SHEL3 U$1.SHEL2 30.9,3.35 U$1.SHEL1
N$8
  Top 0.305: R12.1 12.9,13 11,11.1 8.5,11.1 7.26,12.34 U4.2
N$9
  Top 0.305: R12.2 12.05,15.65 10.9,14.5 10.9,12.4 10.3,11.8 9.1,11.8 8.54,12.37 U4.3
RTS_CP  (via drill 0.45 pad 1)
  Top 0.305: Q2.2 35.15,25.24 R3.2 v33.1,23.4
  Bottom 0.305: U2.24 37.2,15.4 37.7,15.9 37.7,22.3 36.6,23.4 v33.1,23.4
RXD_ESP
  Top 0.305: U1.34 41.07,47.33 43.35,45.05 43.35,43.25 43.95,42.65 43.95,40.95 45.36,39.54 J1.6
  Bottom 0.305: J1.6 45.36,38.66 43.9,37.2 43.9,33.3 37.8,27.2 37.8,26 38.9,24.9 38.9,15.1 38.2,14.4 U2.26
SD0
  Top 0.305: U1.21 32.42,33.08 34.7,30.8 38.6,30.8 39.2,30.2 39.2,28.8 39.8,28.2 39.8,26.5 40.4,25.9 40.4,24.4 41,23.8 41,22.1 41.6,21.5 41.6,19.7 42.2,19.1 42.2,17.3 42.8,16.7 42.8,15 43.4,14.4 43.4,12.7 44,12.1 44,10.3 45.36,8.94 J2.9
SD1  (via drill 0.45 pad 1)
  Top 0.305: U1.22 33.69,33.11 35.4,31.4 38.9,31.4 39.8,30.5 39.8,29 40.4,28.4 40.4,26.7 41,26.1 41,24.6 41.6,24 41.6,22.3 42.2,21.7 42.2,19.9 42.8,19.3 42.8,17.5 43.4,16.9 43.4,15.2 44,14.6 44,12.9 45.36,11.54 J2.8 | U5.1 19.6,7.55 R9.2 v21.8,8
  Bottom 0.305: J2.8 45.36,10.56 43.9,9.1 43.9,7.9 39.6,3.6 31,3.6 27.7,6.9 23.7,6.9 22.6,8 v21.8,8
SD2
  Top 0.305: U1.17 27.34,33.14 26.3,32.1 21.1,32.1 20.3,31.3 20.3,29.3 19.7,28.7 19.7,27 19.1,26.4 19.1,24.6 18.5,24 18.5,22.7 17.9,22.1 17.9,20.3 17.3,19.7 17.3,18 15.83,16.53 J6.6
SD3
  Top 0.305: U1.18 28.61,33.11 27,31.5 21.3,31.5 20.9,31.1 20.9,29.1 20.3,28.5 20.3,26.8 19.7,26.2 19.7,24.4 19.1,23.8 19.1,22.5 18.5,21.9 18.5,20.1 17.9,19.5 17.9,17.6 17.3,17 17.3,15.4 15.83,13.93 J6.7
SUSPEND-
  Bottom 0.305: U2.11 31.1,14.9 30.42,15.58 R6.2
SVN
  Top 0.305: U1.5 19.73,47.33 16.47,44.07 J5.4
SVP
  Top 0.305: J5.3 17.95,46.6 19.95,48.6 U1.4
TXD_ESP
  Top 0.305: U1.35 41.3,48.6 43.35,46.55 43.35,45.8 43.95,45.2 43.95,43.4 45.36,41.99 J1.5
  Bottom 0.305: J1.5 45.36,41.16 43.9,39.7 43.9,38.1 43.3,37.5 43.3,33.6 37.34,27.64 37.34,25.56 38.3,24.6 38.3,15.4 37.8,14.9 U2.25
V+
  Top 0.305: U4.8 4.02,16.95 C13.1 2.8,32.7 3.8,33.7 U$4.PT1
  pour Bottom (no thermals): 1.7,34.6 3.2,36.1 8.4,36.1 9.5,35 9.5,32.3 8.3,31.1 3.2,31.1 1.7,32.6
  pour Top (no thermals): 1.7,34.6 3.2,36.1 8.4,36.1 9.5,35 9.5,32.3 8.3,31.1 4.7,31.1 3.1,29.5 3.1,21.4 4.5,20 6,20 6.5,19.5 6.5,17.3 5.5,16.3 2.9,16.3 1.7,17.5
V-
  Top 0.305: U4.5 9.8,19.62 10.51,20.32 11.51,20.32 12.7,21.52 C14.1 10.85,21.55 8.7,23.7 U$4.PT3
  pour Bottom (no thermals): 3.2,26 8.3,26 9.6,24.7 9.6,22.4 8.4,21.2 3.1,21.2 1.7,22.6 1.7,24.5
  pour Top (no thermals): 4.3,25.1 4.3,23 5.1,22.2 8.4,22.2 9.4,21.2 9.4,18.6 9.8,18.2 10.2,18.2 12.2,20.2 12.2,21.9 8.1,26 5.2,26
VCC
  Bottom 0.305: JP1.3 13,40.32 C10.1 8.3,43.4 5.3,46.4 U$2.PT2
  pour Bottom (no thermals): 2.9,50.6 4.4,52.1 6.1,52.1 7.7,50.5 7.7,46.1 9.7,44.1 13.4,44.1 14.3,43.2 14.3,40 13.6,39.3 12.5,39.3 12,39.8 12,41.4 11,42.4 6.7,42.4 2.9,46.2
VIN  (via drill 0.45 pad 1)
  Top 0.305: C1.1 29.76,30.46 29.23,29.93 IC1.3 27.37,28.47 26.2,27.3 26.2,24.9 24.9,23.6 v21.7,23.6 | JP1.2 JP1.4 9,40.3 8.12,39.76 R7.1
  Bottom 0.305: 10.44,37.53 JP1.2 10.44,36.96 11.1,36.3 13,36.3 14.4,34.9 14.4,20.5 13.7,19.8 12.9,19.8 12.3,19.2 12.3,18.3 12.9,17.7 13.8,17.7 14.4,17.1 14.4,7.8 15.1,7.1 16.6,7.1 17.3,7.8 17.3,21.2 19.7,23.6 v21.7,23.6
  pour Bottom (isolate 0.305, no thermals): 9.2,41 9.8,41.6 11,41.6 11.5,41.1 11.5,37.2 12.2,36.5 13,36.5 14.5,35 14.5,20.4 13.7,19.6 13,19.6 12.5,19.1 12.5,18.4 13,17.9 13.9,17.9 14.6,17.2 14.6,7.9 15.3,7.2 16.5,7.2 17.2,7.9 17.2,23.2 18.3,24.3 21.7,24.3 22.2,23.8 22.2,23.1 20.7,21.6 20.7,10.4 19.4,9.1 19.4,5.3 18.3,4.2 15,4.2 13.7,5.5 13.7,7.6 9.6,11.7 9.6,20.2 11.3,21.9 11.3,34.9 9.2,37
VRELE
  Top 0.305: U4.7 7.26,17.07 5.1,14.9 5.1,10.3 6.2,9.2 U$3.PT1
  pour Bottom (no thermals): 3.8,3.1 3.8,8.4 5.1,9.7 7.5,9.7 8.7,8.5 8.7,2.9 7.5,1.7 5.2,1.7
VUSB  (via drill 0.45 pad 1)
  Top 0.305: U$1.P1 32.7,6.1 31.43,7.37 C7.1 31.15,9.35 v31,9.5 | v31,9.5 30.95,9.54 29.2,9.53 C8.1 27.8,8.47 27.8,3.4 26.2,1.8 18.4,1.8 16.8,3.4 16.8,5.4 14.4,7.8 14.4,37 13.64,37.76 JP1.1 | v31.5,12.4 31.5,10 v31,9.5
  Bottom 0.305: U3.5 32.41,9.5 v31,9.5 | U2.8 31.5,13.4 31.3,13.2 31.3,12.6 v31.5,12.4 31.77,12.13 32.27,12.13 32.57,12.43 U2.7

### Text on the board
tNames: GND | GND | 3.3V | 3.3V | SVP | IO23 | SVN | IO22 | VCC | VCC | IO34 | TXD | VIN | IO35 | RXD | VIN | IO32 | IO21 | V+ | VUSB | IO33 | IO19 | IO25 | IO18 | IO26 | IO5 | IO27 | IO17 | V- | IO14 | IO16 | IO12 | IO4 | IO13 | IO0 | SD2 | IO2 | SD3 | IO15 | VRELE | CMD | SD1 | CLK | SD0
bNames: EN | GND | NILM_UIS / J. Nicolas Riaño T. / Edwin Paez G. | GND | GND